# Altium schematic sheet Option_LighterSensor.SchDoc
size 297 x 209 mm
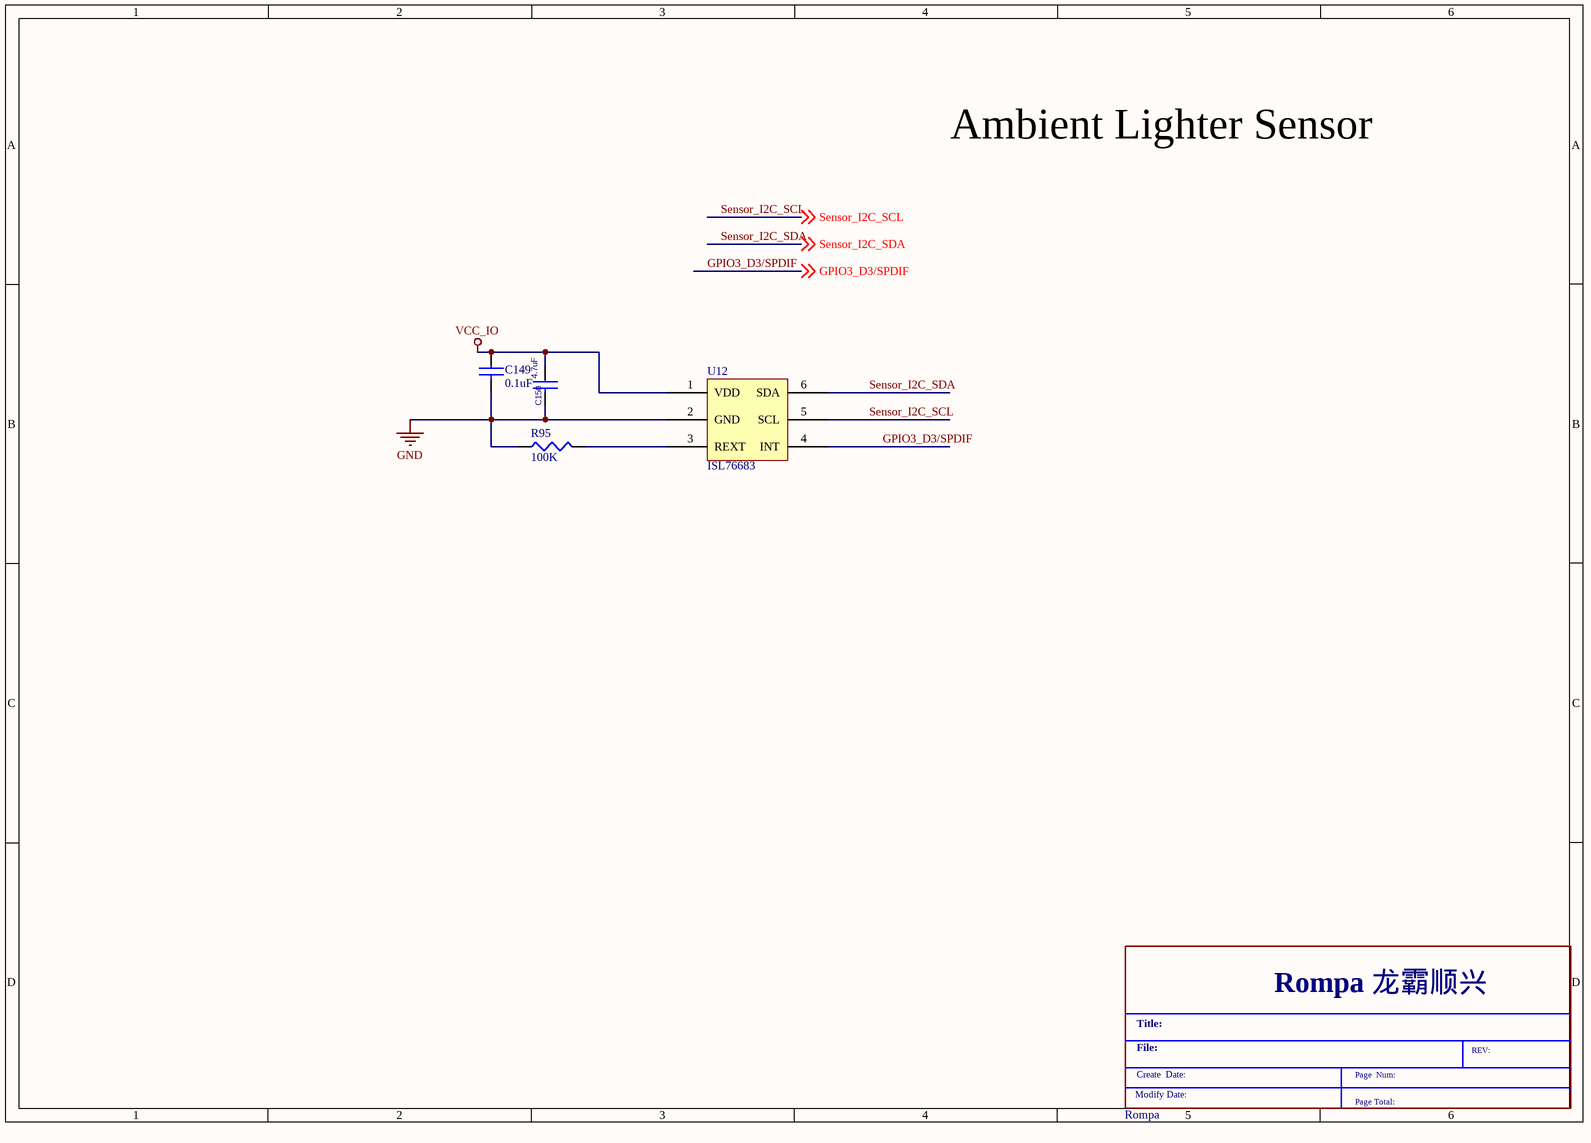
[diagram p0: Option_LighterSensor.SchDoc]

## Parts
*  Rompa  (graphical)
C149  0.1uF  [C0402]
C150  4.7uF  [C0603]
R95  100K  [R0402]
U12  ISL76683

## Nets
GND: C149.2 C150.2 R95.1 U12.2(GND)
VCC_IO: C149.1 C150.1 U12.1(VDD)
GPIO3_D3/SPDIF: U12.4(INT) ; off-sheet GPIO3_D3/SPDIF
Sensor_I2C_SCL: U12.5(SCL) ; off-sheet Sensor_I2C_SCL
Sensor_I2C_SDA: U12.6(SDA) ; off-sheet Sensor_I2C_SDA
NetR95_2: R95.2 U12.3(REXT)

## Notes on the sheet
- Ambient Lighter Sensor
- (in symbol Rompa) Rompa 龙霸顺兴; Title:; File:; REV:; Create  Date:; Page  Num:; Modify Date:; Page Total:

## Library data of the parts
C149 = CAP NP
C150 = CAP NP_4
R95 = RESISTOR